# EasyEDA schematic SCH_CheetahSpeedometer_2024-07-13.json
TITLE: Cheetah Speedometer; REV: 1.0; Date: 2024-07-13; Sheet: 1/1; Drawn By: Matt Lin; Company: Your Company
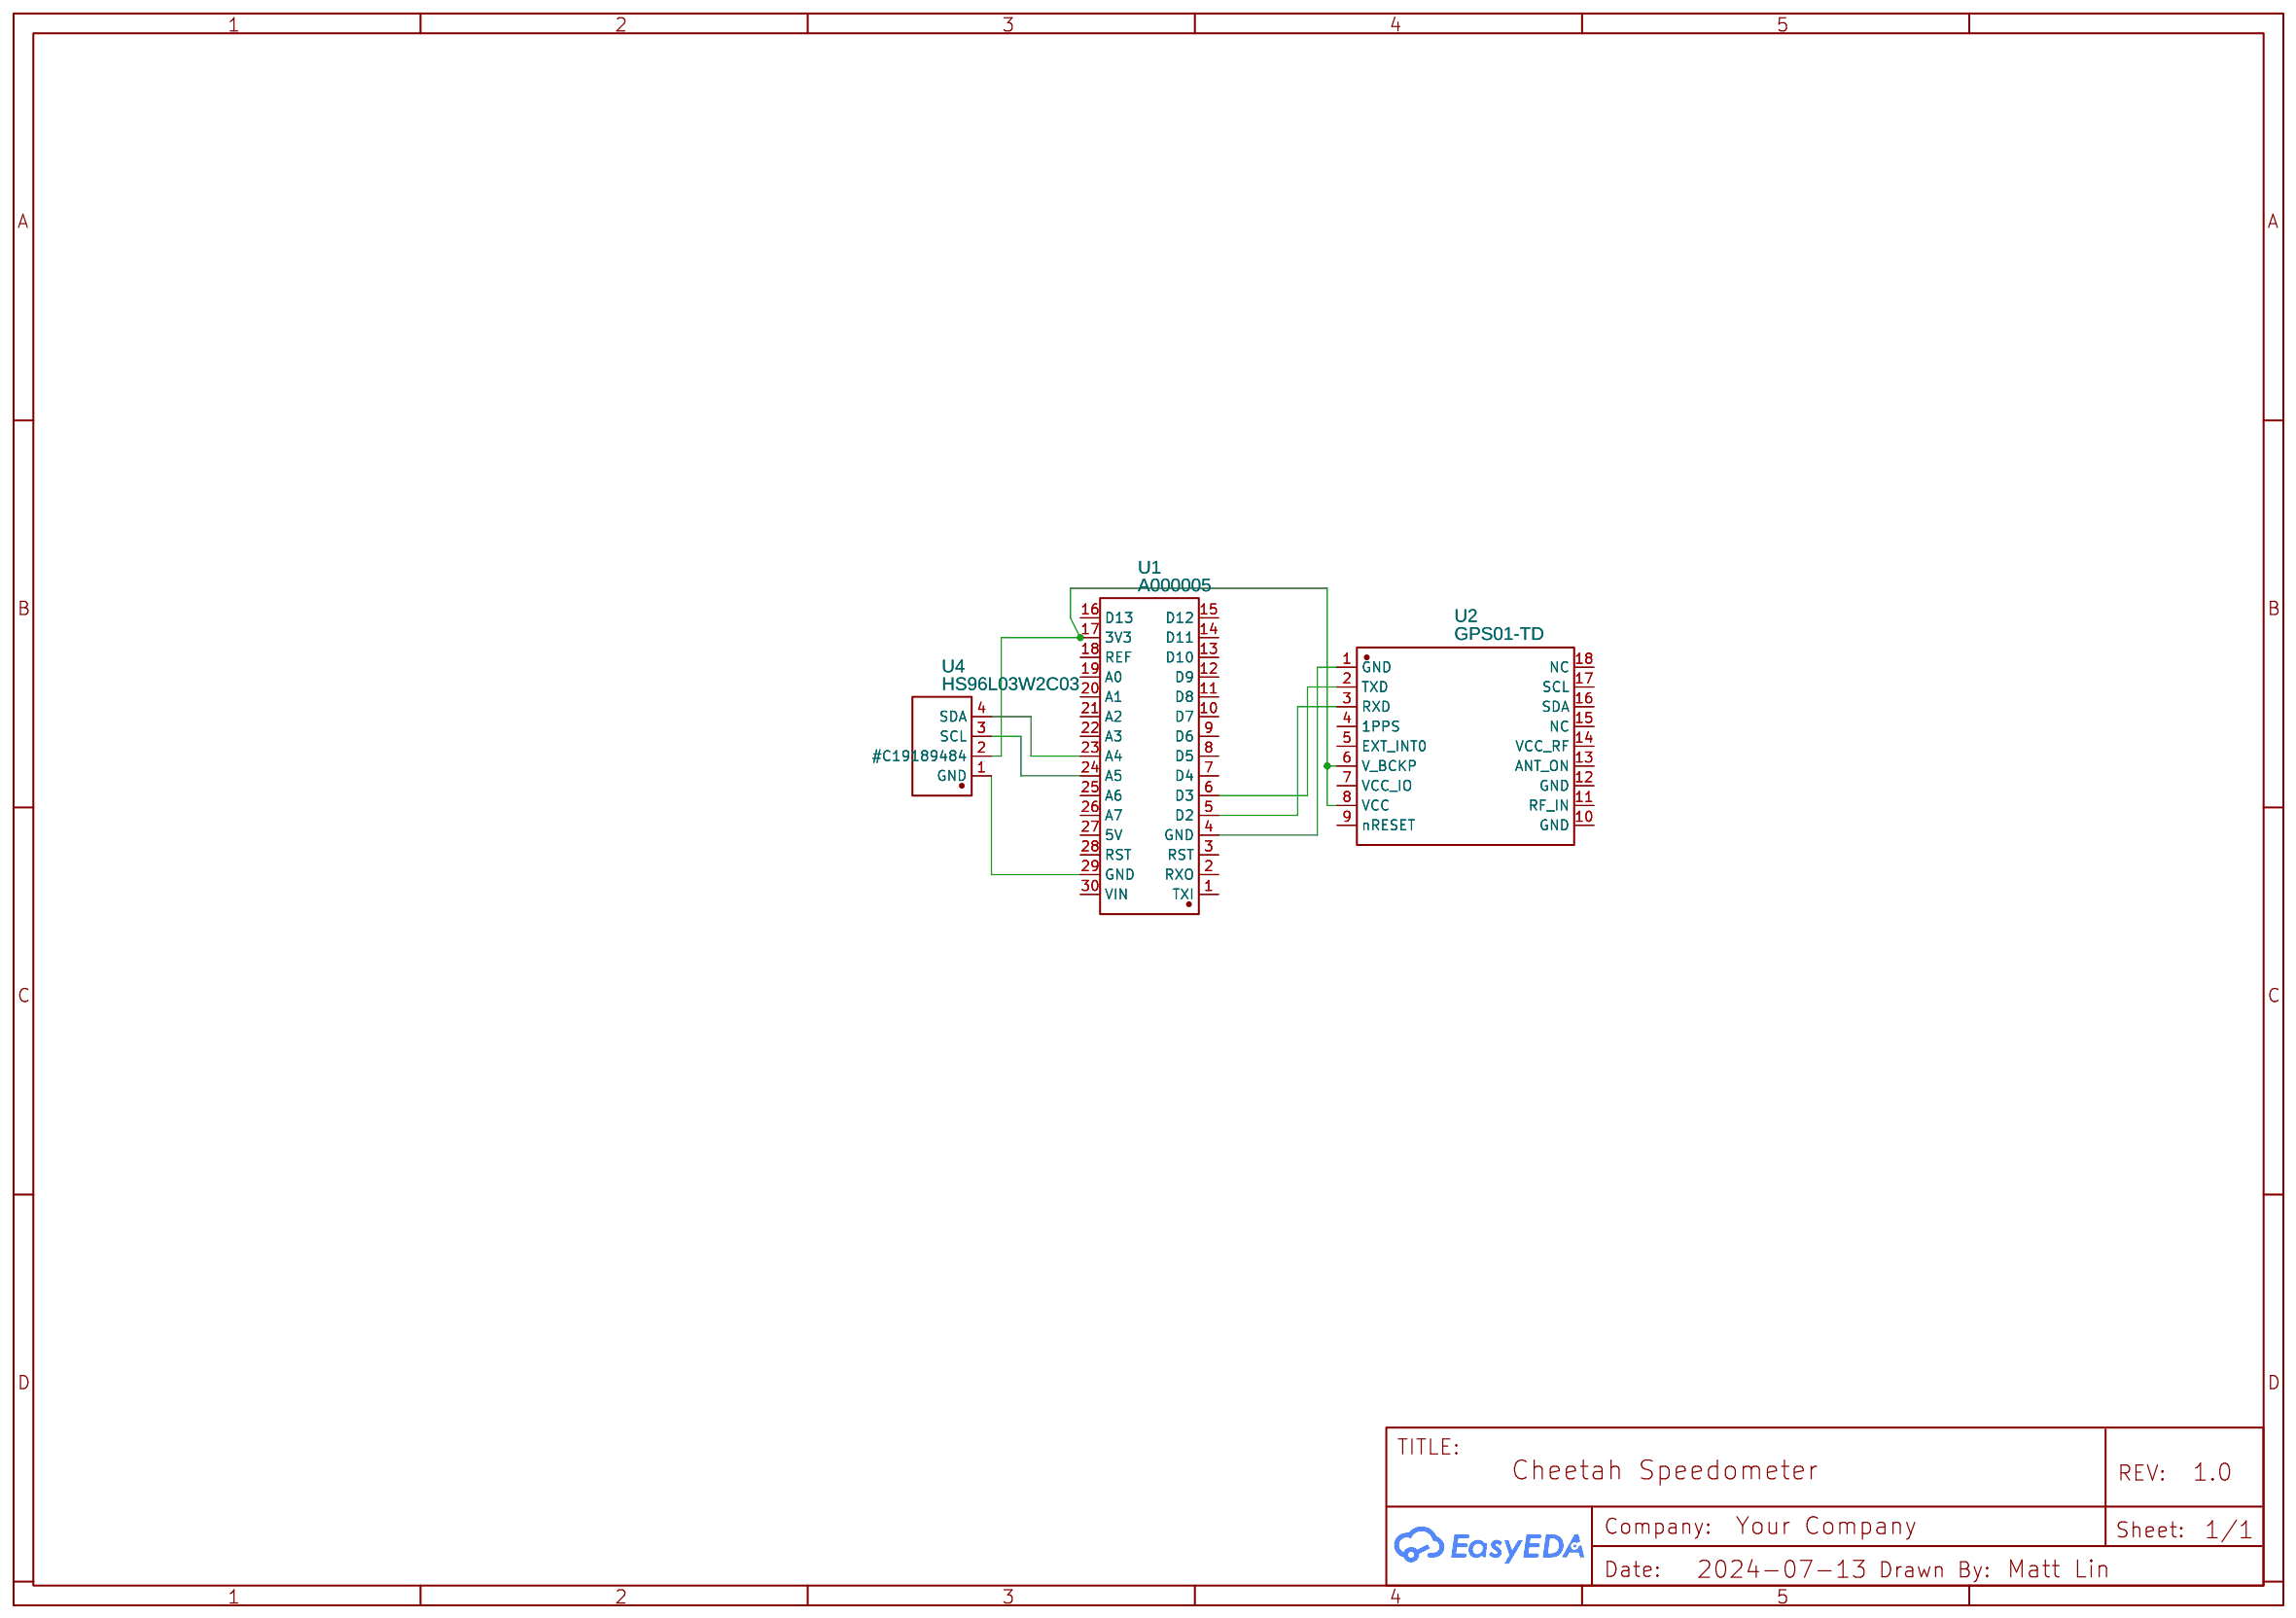
[diagram p0: schematic sheet]

## Parts
U1  A000005  [COMM-TH_A000005]
U2  GPS01-TD  [WIRELM-SMD_18P-L10.1-W9.9_P1.10-TL]
U4  HS96L03W2C03  [OLED-TH_L27.8-W27.2-P2.54_C9900033791]

## Library data of the parts
U1 = A000005: Supplier: LCSC; Supplier Part: C19189484; Manufacturer: arduino; JLCPCB Part Class: Extended Part; Contributor: lcsc
U2 = GPS01-TD: Contributor: lcsc; Supplier: LCSC; Supplier Part: C5356635; Manufacturer: G-NiceRF(思为无线)
U4 = HS96L03W2C03: Contributor: lcsc; Supplier: LCSC; Supplier Part: C5248080; Manufacturer: HS(汉昇); JLCPCB Part Class: Extended Part

## Nets
Net-(U1-4): U1.4(GND) U2.1(GND)
Net-(U1-5): U1.5(D2) U2.3(RXD)
Net-(U1-6): U1.6(D3) U2.2(TXD)
Net-(U1-17): U1.17(3V3) U2.6(V_BCKP) U2.8(VCC) U4.2(#C19189484)
Net-(U1-23): U1.23(A4) U4.4(SDA)
Net-(U1-24): U1.24(A5) U4.3(SCL)
Net-(U1-29): U1.29(GND) U4.1(GND)

Not connected (* = marked no-connect by the designer): U1 1(TXI) 2(RXO) 3(RST) 7(D4) 8(D5) 9(D6) 10(D7) 11(D8) 12(D9) 13(D10) 14(D11) 15(D12) 16(D13) 18(REF) 19(A0) 20(A1) 21(A2) 22(A3) 25(A6) 26(A7) 27(5V) 28(RST) 30(VIN); U2 4(1PPS) 5(EXT_INT0) 7(VCC_IO) 9(nRESET) 10(GND) 11(RF_IN) 12(GND) 13(ANT_ON) 14(VCC_RF) 15(NC) 16(SDA) 17(SCL) 18(NC)
